# EAGLE schematic JTAG (EAGLE 9.6.2)
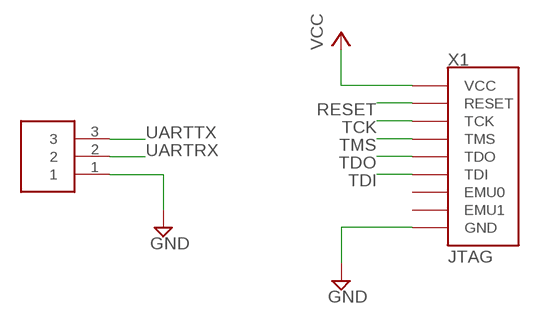
[diagram p0: schematic, sheet 1]

## Parts
U$1  HEADER-3  [HEADER-V-1X3]
X1  JTAG  [HEADER-V-2X7]

## Nets
GND: U$1.1 X1.4(GND) X1.6(GND) X1.8(GND) X1.10(GND) X1.12(GND)
RESET: X1.2(RESET)
TCK: X1.9(TCK) X1.11(TCK)
TDI: X1.3(TDI)
TDO: X1.7(TDO)
TMS: X1.1(TMS)
UARTRX: U$1.2
UARTTX: U$1.3
VCC: X1.5(VCC)
Unconnected: X1.13(EMU0) X1.14(EMU1)

## Library data of the parts
U$1 = gtsr-connector:HEADER-3; MANUFACTURER: Molex; MFPN: 0901200763; SUPPLIER: Digikey; SUPPLIER_PN: WM8085-ND
X1 = gtsr-connector:JTAG; MANUFACTURER: TE Connectivity; MFPN: 2-1761603-5; SUPPLIER: Digikey; SUPPLIER_PN: A97471-ND